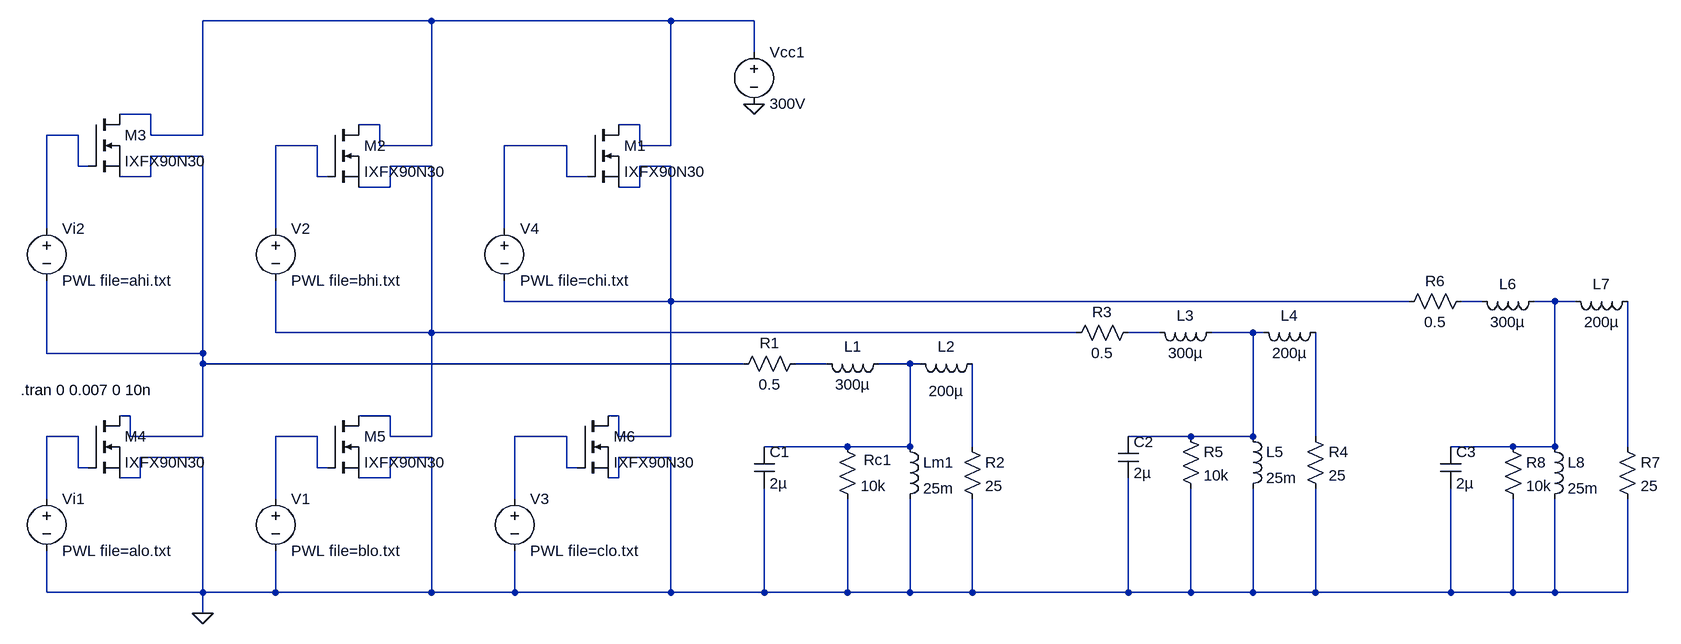
[diagram p0: schematic MosfertVersion.asc]
MosfertVersion.asc, the LTspice schematic file:
Version 4
SHEET 1 1912 1140
WIRE 16 208 -336 208
WIRE 384 208 16 208
WIRE 512 208 384 208
WIRE 512 256 512 208
WIRE -416 352 -464 352
WIRE -64 368 -96 368
WIRE 336 368 304 368
WIRE -528 384 -576 384
WIRE -416 384 -416 352
WIRE -336 384 -336 208
WIRE -336 384 -416 384
WIRE -160 400 -224 400
WIRE -64 400 -64 368
WIRE 16 400 16 208
WIRE 16 400 -64 400
WIRE 224 400 128 400
WIRE 336 400 336 368
WIRE 384 400 384 208
WIRE 384 400 336 400
WIRE -336 416 -416 416
WIRE -528 432 -528 384
WIRE -512 432 -528 432
WIRE 16 432 -48 432
WIRE 384 432 336 432
WIRE -416 448 -416 416
WIRE -416 448 -464 448
WIRE -160 448 -160 400
WIRE -144 448 -160 448
WIRE 224 448 224 400
WIRE 256 448 224 448
WIRE -48 464 -48 432
WIRE -48 464 -96 464
WIRE 336 464 336 432
WIRE 336 464 304 464
WIRE -576 528 -576 384
WIRE -224 528 -224 400
WIRE 128 528 128 400
WIRE 128 640 128 608
WIRE 384 640 384 432
WIRE 384 640 128 640
WIRE 1520 640 384 640
WIRE 1632 640 1600 640
WIRE 1744 640 1712 640
WIRE 1776 640 1744 640
WIRE -224 688 -224 608
WIRE 16 688 16 432
WIRE 16 688 -224 688
WIRE 1008 688 16 688
WIRE 1136 688 1088 688
WIRE 1280 688 1216 688
WIRE 1296 688 1280 688
WIRE -576 720 -576 608
WIRE -336 720 -336 416
WIRE -336 720 -576 720
WIRE -336 736 -336 720
WIRE 496 736 -336 736
WIRE 624 736 576 736
WIRE 752 736 704 736
WIRE 768 736 752 736
WIRE -448 816 -464 816
WIRE -48 816 -96 816
WIRE 304 816 288 816
WIRE -528 848 -576 848
WIRE -448 848 -448 816
WIRE -336 848 -336 736
WIRE -336 848 -448 848
WIRE -160 848 -224 848
WIRE -48 848 -48 816
WIRE 16 848 16 688
WIRE 16 848 -48 848
WIRE 224 848 144 848
WIRE 304 848 304 816
WIRE 384 848 384 640
WIRE 384 848 304 848
WIRE 1184 848 1088 848
WIRE 1280 848 1280 688
WIRE 1280 848 1184 848
WIRE 1376 848 1376 688
WIRE 656 864 528 864
WIRE 752 864 752 736
WIRE 752 864 656 864
WIRE 848 864 848 736
WIRE 1680 864 1584 864
WIRE 1744 864 1744 640
WIRE 1744 864 1680 864
WIRE 1856 864 1856 640
WIRE -336 880 -432 880
WIRE 16 880 -48 880
WIRE 384 880 304 880
WIRE -528 896 -528 848
WIRE -512 896 -528 896
WIRE -160 896 -160 848
WIRE -144 896 -160 896
WIRE 224 896 224 848
WIRE 240 896 224 896
WIRE -432 912 -432 880
WIRE -432 912 -464 912
WIRE -48 912 -48 880
WIRE -48 912 -96 912
WIRE 304 912 304 880
WIRE 304 912 288 912
WIRE -576 944 -576 848
WIRE -224 944 -224 848
WIRE 144 944 144 848
WIRE -576 1088 -576 1024
WIRE -336 1088 -336 880
WIRE -336 1088 -576 1088
WIRE -224 1088 -224 1024
WIRE -224 1088 -336 1088
WIRE 16 1088 16 880
WIRE 16 1088 -224 1088
WIRE 144 1088 144 1024
WIRE 144 1088 16 1088
WIRE 384 1088 384 880
WIRE 384 1088 144 1088
WIRE 528 1088 528 928
WIRE 528 1088 384 1088
WIRE 656 1088 656 944
WIRE 656 1088 528 1088
WIRE 752 1088 752 944
WIRE 752 1088 656 1088
WIRE 848 1088 848 944
WIRE 848 1088 752 1088
WIRE 1088 1088 1088 912
WIRE 1088 1088 848 1088
WIRE 1184 1088 1184 928
WIRE 1184 1088 1088 1088
WIRE 1280 1088 1280 928
WIRE 1280 1088 1184 1088
WIRE 1376 1088 1376 928
WIRE 1376 1088 1280 1088
WIRE 1584 1088 1584 928
WIRE 1584 1088 1376 1088
WIRE 1680 1088 1680 944
WIRE 1680 1088 1584 1088
WIRE 1744 1088 1744 944
WIRE 1744 1088 1680 1088
WIRE 1856 1088 1856 944
WIRE 1856 1088 1744 1088
WIRE -336 1120 -336 1088
FLAG -336 1120 0
FLAG 512 336 0
SYMBOL voltage -576 928 R0
WINDOW 123 0 0 Left 2
WINDOW 39 0 0 Left 2
SYMATTR InstName Vi1
SYMATTR Value PWL file=alo.txt
SYMBOL voltage -576 512 R0
WINDOW 123 0 0 Left 2
WINDOW 39 0 0 Left 2
SYMATTR InstName Vi2
SYMATTR Value PWL file=ahi.txt
SYMBOL voltage 512 240 R0
WINDOW 123 0 0 Left 2
WINDOW 39 9 129 Left 2
SYMATTR InstName Vcc1
SYMATTR Value 300V
SYMBOL res 592 720 R90
WINDOW 0 0 56 VBottom 2
WINDOW 3 32 56 VTop 2
SYMATTR InstName R1
SYMATTR Value 0.5
SYMBOL ind 720 720 R90
WINDOW 0 5 56 VBottom 2
WINDOW 3 32 56 VTop 2
SYMATTR InstName L1
SYMATTR Value 300µ
SYMBOL ind 864 720 R90
WINDOW 0 5 56 VBottom 2
WINDOW 3 42 56 VTop 2
SYMATTR InstName L2
SYMATTR Value 200µ
SYMBOL res 832 848 R0
SYMATTR InstName R2
SYMATTR Value 25
SYMBOL res 640 848 R0
WINDOW 0 41 36 Left 2
SYMATTR InstName Rc1
SYMATTR Value 10k
SYMBOL ind 736 848 R0
SYMATTR InstName Lm1
SYMATTR Value 25m
SYMBOL cap 512 864 R0
SYMATTR InstName C1
SYMATTR Value 2µ
SYMBOL voltage -224 928 R0
WINDOW 123 0 0 Left 0
WINDOW 39 0 0 Left 0
SYMATTR InstName V1
SYMATTR Value PWL file=blo.txt
SYMBOL voltage -224 512 R0
WINDOW 123 0 0 Left 0
WINDOW 39 0 0 Left 0
SYMATTR InstName V2
SYMATTR Value PWL file=bhi.txt
SYMBOL voltage 144 928 R0
WINDOW 123 0 0 Left 0
WINDOW 39 0 0 Left 0
SYMATTR InstName V3
SYMATTR Value PWL file=clo.txt
SYMBOL voltage 128 512 R0
WINDOW 123 0 0 Left 0
WINDOW 39 0 0 Left 0
SYMATTR InstName V4
SYMATTR Value PWL file=chi.txt
SYMBOL res 1104 672 R90
WINDOW 0 0 56 VBottom 2
WINDOW 3 32 56 VTop 2
SYMATTR InstName R3
SYMATTR Value 0.5
SYMBOL ind 1232 672 R90
WINDOW 0 5 56 VBottom 2
WINDOW 3 32 56 VTop 2
SYMATTR InstName L3
SYMATTR Value 300µ
SYMBOL ind 1392 672 R90
WINDOW 0 5 56 VBottom 2
WINDOW 3 32 56 VTop 2
SYMATTR InstName L4
SYMATTR Value 200µ
SYMBOL res 1360 832 R0
SYMATTR InstName R4
SYMATTR Value 25
SYMBOL res 1168 832 R0
SYMATTR InstName R5
SYMATTR Value 10k
SYMBOL ind 1264 832 R0
SYMATTR InstName L5
SYMATTR Value 25m
SYMBOL cap 1072 848 R0
SYMATTR InstName C2
SYMATTR Value 2µ
SYMBOL res 1616 624 R90
WINDOW 0 0 56 VBottom 2
WINDOW 3 32 56 VTop 2
SYMATTR InstName R6
SYMATTR Value 0.5
SYMBOL ind 1728 624 R90
WINDOW 0 5 56 VBottom 2
WINDOW 3 32 56 VTop 2
SYMATTR InstName L6
SYMATTR Value 300µ
SYMBOL ind 1872 624 R90
WINDOW 0 5 56 VBottom 2
WINDOW 3 32 56 VTop 2
SYMATTR InstName L7
SYMATTR Value 200µ
SYMBOL res 1840 848 R0
SYMATTR InstName R7
SYMATTR Value 25
SYMBOL res 1664 848 R0
SYMATTR InstName R8
SYMATTR Value 10k
SYMBOL ind 1728 848 R0
SYMATTR InstName L8
SYMATTR Value 25m
SYMBOL cap 1568 864 R0
SYMATTR InstName C3
SYMATTR Value 2µ
SYMBOL nmos 256 368 R0
SYMATTR InstName M1
SYMATTR Value IXFX90N30
SYMBOL nmos -144 368 R0
SYMATTR InstName M2
SYMATTR Value IXFX90N30
SYMBOL nmos -512 352 R0
SYMATTR InstName M3
SYMATTR Value IXFX90N30
SYMBOL nmos -512 816 R0
SYMATTR InstName M4
SYMATTR Value IXFX90N30
SYMBOL nmos -144 816 R0
SYMATTR InstName M5
SYMATTR Value IXFX90N30
SYMBOL nmos 240 816 R0
SYMATTR InstName M6
SYMATTR Value IXFX90N30
TEXT -616 776 Left 2 !.tran 0 0.007 0 10n

The netlist it stands for:
* MosfertVersion.asc
Vi1 N014 0 PWL file=alo.txt
Vi2 N002 N005 PWL file=ahi.txt
Vcc1 N001 0 300V
R1 N012 N005 0.5
L1 N013 N012 300µ
L2 N018 N013 200µ
R2 N018 0 25
Rc1 N013 0 10k
Lm1 N013 0 25m
C1 N013 0 2µ
V1 N015 0 PWL file=blo.txt
V2 N003 N006 PWL file=bhi.txt
V3 N016 0 PWL file=clo.txt
V4 N004 N007 PWL file=chi.txt
R3 N010 N006 0.5
L3 N011 N010 300µ
L4 N017 N011 200µ
R4 N017 0 25
R5 N011 0 10k
L5 N011 0 25m
C2 N011 0 2µ
R6 N008 N007 0.5
L6 N009 N008 300µ
L7 N019 N009 200µ
R7 N019 0 25
R8 N009 0 10k
L8 N009 0 25m
C3 N009 0 2µ
M1 N001 N004 N007 N007 IXFX90N30
M2 N001 N003 N006 N006 IXFX90N30
M3 N001 N002 N005 N005 IXFX90N30
M4 N005 N014 0 0 IXFX90N30
M5 N006 N015 0 0 IXFX90N30
M6 N007 N016 0 0 IXFX90N30
.model NMOS NMOS
.model PMOS PMOS
.lib standard.mos
.tran 0 0.007 0 10n
.backanno
.end